# EAGLE design MAX1551_LiPo_Charger_Circuit_Ver01 (EAGLE 5.11)
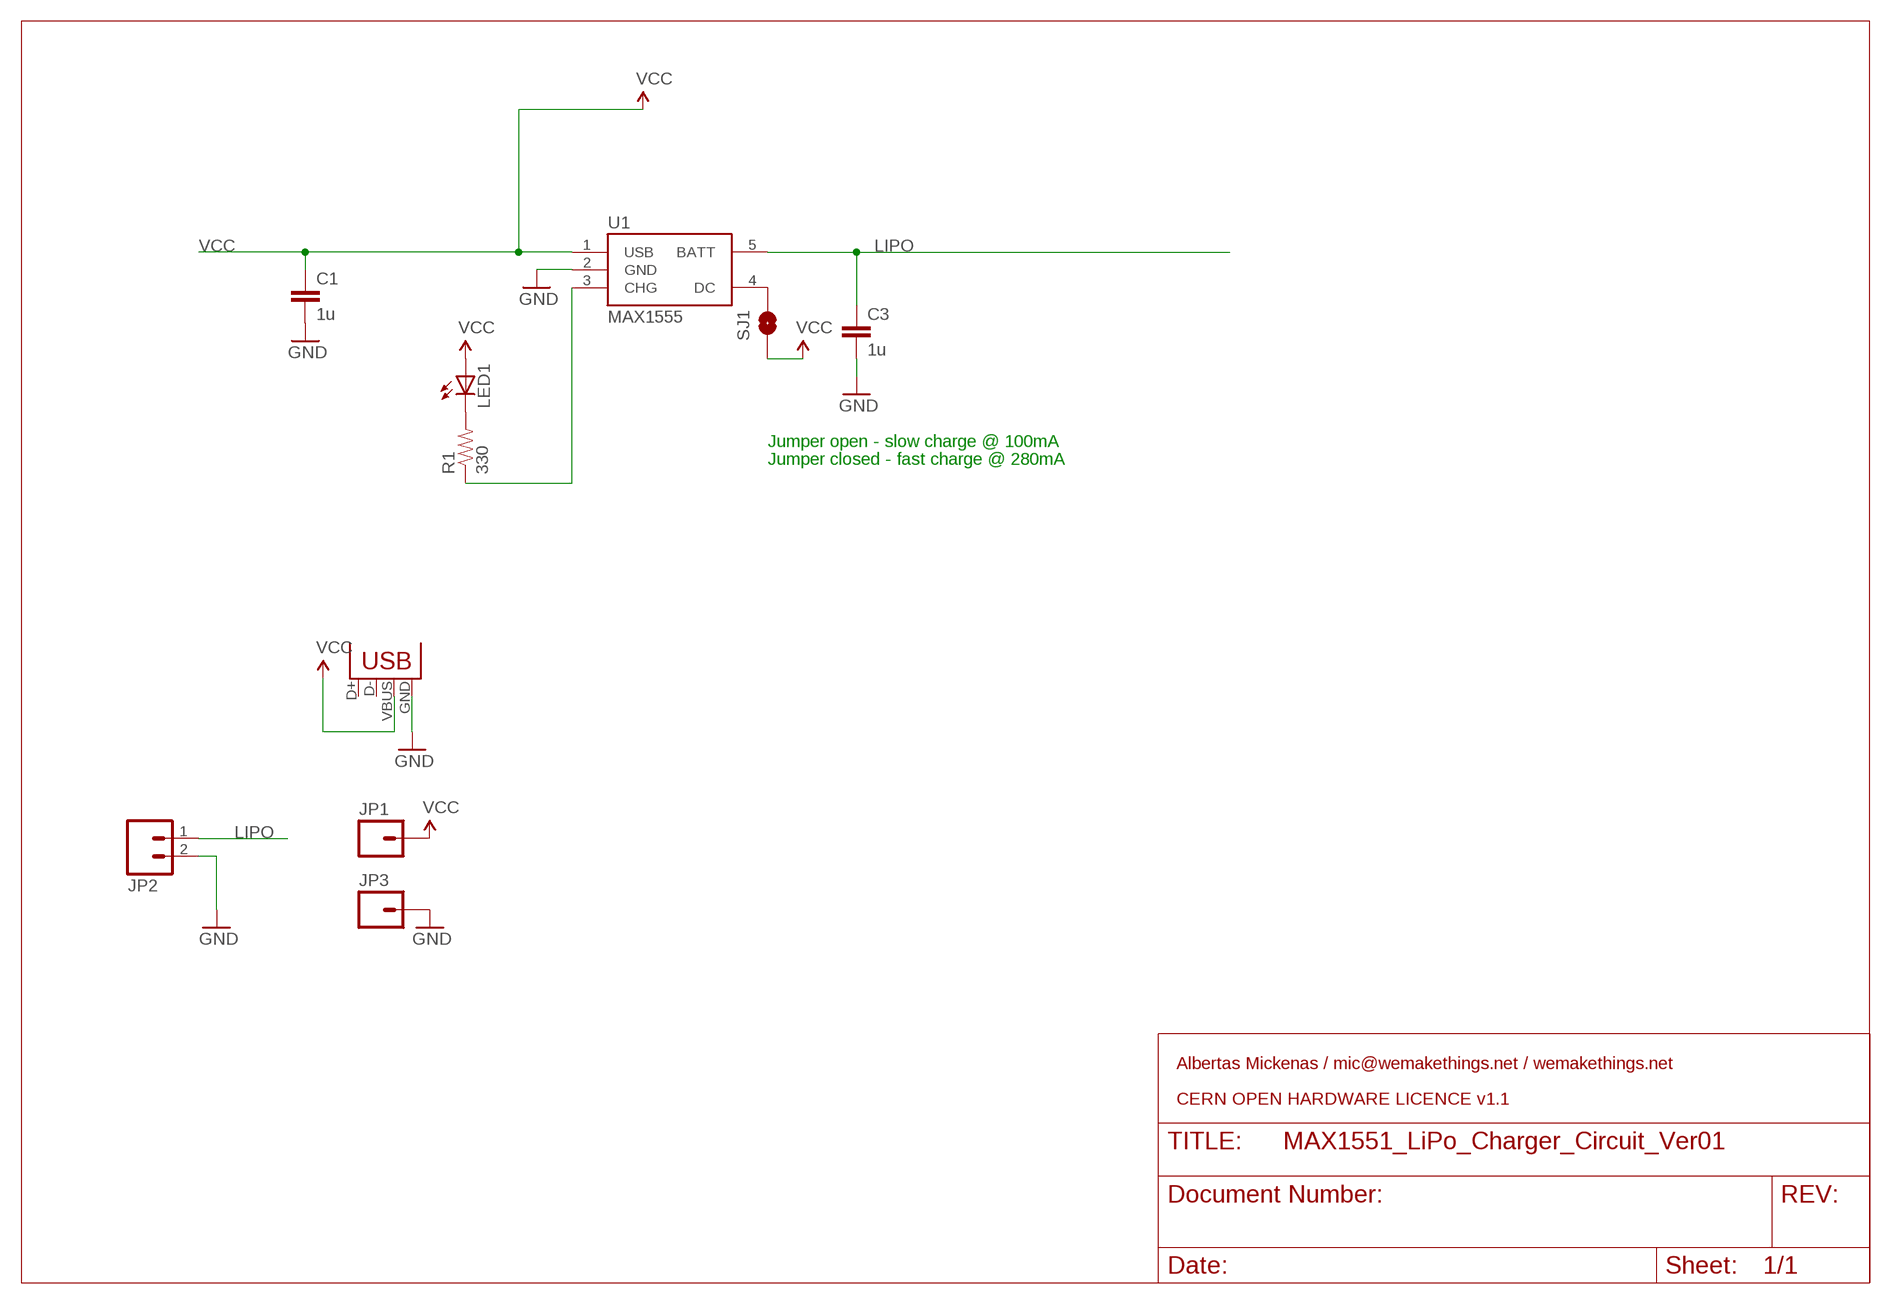
[diagram p0: schematic, sheet 1]

## Parts
C1  1u  CAP0805  [0805]
C3  1u  CAP0805  [0805]
JP1  M01PTH_LONGPAD  [1X01_LONGPAD]
JP2  M02PTH3  [1X02_LONGPADS]
JP3  M01PTH_LONGPAD  [1X01_LONGPAD]
LED1  LEDCHIP-LED0805  [CHIP-LED0805]
R1  330  RESISTOR0603-RES  [0603-RES]
SJ1  SOLDERJUMPERNC2  [SJ_2S-NOTRACE]
U1  MAX1555  [SOT23-5]
X1  USBOLD  [USB-MINIB-OLD]

## Nets
GND: C1.2 C3.2 JP2.2 JP3.1 U1.2(GND) X1.GND
LIPO: C3.1 JP2.1 U1.5(BATT)
N$1: R1.1 U1.3(CHG)
N$3: LED1.C R1.2
N$6: SJ1.2 U1.4(DC)
VCC: C1.1 JP1.1 LED1.A SJ1.1 U1.1(USB) X1.VBUS
Unconnected: X1.D+ X1.D-

## Notes on the sheet
- Jumper open - slow charge @ 100mA
- Jumper closed - fast charge @ 280mA
- Albertas Mickenas / mic@wemakethings.net / wemakethings.net
- CERN OPEN HARDWARE LICENCE v1.1

## Library data of the parts
C1 C3 = SparkFun:CAP: Capacitor Standard 0603 ceramic capacitor, and 0.1" leaded capacitor.
JP1 JP3 = SparkFun:M01: Header 1 Standard 1-pin 0.1" header. Use with straight break away headers (SKU : PRT-00116), right angle break away headers (PRT-00553), swiss pins (PRT-00743), machine pins (PRT-00117), and female headers (PRT-00115).
JP2 = SparkFun:M02: Header 2 Standard 2-pin 0.1" header. Use with straight break away headers (SKU : PRT-00116), right angle break away headers (PRT-00553), swiss pins (PRT-00743), machine pins (PRT-00117), and female headers (PRT-00115). Molex polarized connector foot print use with SKU : PRT-08233 with associated crimp pins and housings.
LED1 = adafruit:LED: LED OSRAM: - CHIPLED LG R971, LG N971, LY N971, LG Q971, LY Q971, LO R971, LY R971 LH N974, LH R974 LS Q976, LO Q976, LY Q976 LO Q996 - Hyper CHIPLED LW Q18S LB Q993, LB Q99A, LB R99A - SideLED LS A670, LO A670, LY A670, LG A670, LP A670 LB A673, LV A673, LT A673, LW A673 LH A674 LY A675 LS A676, LA A676, LO A676, LY A676, LW A676 LS A679, LY A679, LG A679 - Hyper Micro SIDELED® LS Y876, LA Y876, LO Y876, LY Y876 LT Y87S - SmartLED LW L88C, LW L88S LB L89C, LB L89S, LG L890 LS L89K, LO L89K, LY L89K LS L896, LA L896, LO L896, LY L896 - TOPLED LS T670, LO T670, LY T670, LG T670, LP T670 LSG T670, LSP T670, LSY T670, LOP T670, LYG T670 LG T671, LOG T671, LSG T671 LB T673, LV T673, LT T673, LW T673 LH T674 LS T676, LA T676, LO T676, LY T676, LB T676, LH T676, LSB T676, LW T676 LB T67C, LV T67C, LT T67C, LS T67K, LO T67K, LY T67K, LW E67C LS E67B, LA E67B, LO E67B, LY E67B, LB E67C, LV E67C, LT E67C LW T67C LS T679, LY T679, LG T679 LS T770, LO T770, LY T770, LG T770, LP T770 LB T773, LV T773, LT T773, LW T773 LH T774 LS E675, LA E675, LY E675, LS T675 LS T776, LA T776, LO T776, LY T776, LB T776 LHGB T686 LT T68C, LB T68C - Hyper Mini TOPLED® LB M676 - Mini TOPLED Santana® LG M470 LS M47K, LO M47K, LY M47K Source: http://www.osram.convergy.de/
R1 = SparkFun:RESISTOR: Resistor Basic schematic elements and footprints for 0603, 1206, and PTH resistors.
SJ1 = SparkFun:SOLDERJUMPER: Solder Jumper Standard SMD solder jumper. Used to automate production. Two varients : Normally Open and Normally Closed are the same, but have different paste layers. NC will have a large amount of paste and should jumper during reflow.
U1 = SparkFun:MAX1555: MAX1555 Lithium Charger IC SOT-23 Lithium Polymer charging IC. Schematic element and footprint proven. Spark Fun Electronics SKU : COM-00674
X1 = SparkFun:USB: USB Connectors USB-B-PTH is fully proven SKU : PRT-00139 USB-miniB is fully proven SKU : PRT-00587 USB-A-PCB is untested. USB-A-H is throughly reviewed, but untested. Spark Fun Electronics SKU : PRT-00437 USB-B-SMT is throughly reviewed, but untested. Needs silkscreen touching up. USB-A-S has not been used/tested USB-MB-H has not been used/tested

## Board
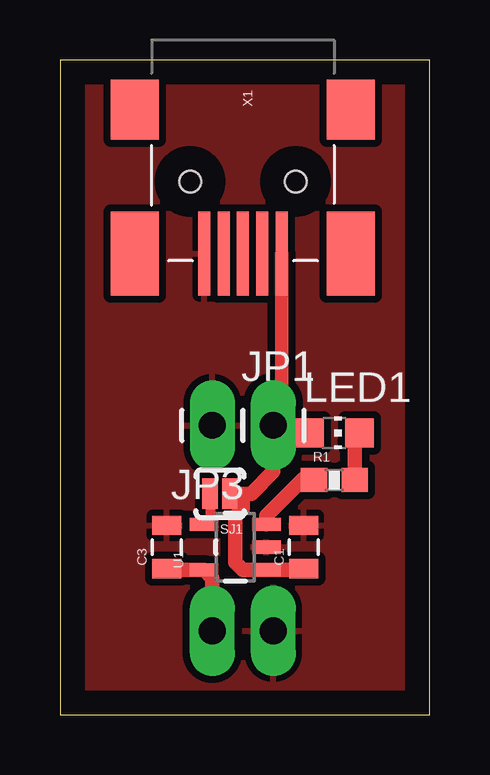
[diagram p1: board, top side]

Size 15.41 x 27.3 mm. Coordinates in mm from the lower left corner, seen from the top.
Outline: 0,0 15.41,0 15.41,27.3 0,27.3 0,0
Copper layers (1*16): Top 0.035mm / dielectric 1.5mm / Bottom 0.035mm
Design rules "default": minimum track width 10mil, minimum drill 24mil, track to track 8mil, track to pad 8mil, pad to pad 8mil, via to via 8mil, smd to smd 8mil, copper to edge 40mil, drill to drill 8mil, minimum pad ring 10mil, minimum via ring 8mil, stop-mask expansion 4mil, vias tented up to drill 0mil, thermal gap 10mil

### Footprints (pad centres in the part's own frame; a part is rotated, then mirrored left to right if it is on the bottom)
0805 = smd 0.8 x 1.2: 1 -0.9,0; 2 0.9,0
1X01_LONGPAD = drill 1.118 pad 1.88 long: 1 0,0
1X02_LONGPADS = drill 1.118 pad 1.88 long: 1 0,0; 2 2.54,0
CHIP-LED0805 = smd 1.2 x 1.2: A 0,-1.05; C 0,1.05
0603-RES = smd 1.1 x 1: 1 -0.85,0; 2 0.85,0
SJ_2S-NOTRACE = smd 0.635 x 1.27: 1 -0.401,0; 2 0.413,0
SOT23-5 = smd 0.55 x 1.2: 1 -0.95,-1.3; 2 0,-1.3; 3 0.95,-1.3; 4 0.95,1.3; 5 -0.95,1.3
USB-MINIB-OLD = smd 2.5 x 2: 1 -3,-4.5; 2 -3,4.5 | smd 3.5 x 2: 3 3,-4.5; 4 3,4.5 | smd 3.5 x 0.5: D+ 3,0; D- 3,0.8; GND 3,-1.6; ID 3,-0.8; VBUS 3.01,1.61 | hole 0.9: 0,2.2; 0,-2.2

### Placement (x,y rotation side)
C1  10.16,6.99 90 top
C3  4.45,6.99 90 top
JP1  8.89,12.06 0 top
JP2  6.35,3.49 0 top
JP3  6.35,12.06 180 top
LED1  11.43,11.75 270 top
R1  11.43,9.78 0 top
SJ1  6.67,9.21 180 top
U1  7.3,6.99 90 top
X1  7.62,22.23 270 top

### Tracks (layer width: path | path; a pad name or v marks a point on that pad's centre or on a via)
GND
  pour Top (isolate 0.305): 0,27.94 15.24,27.94 15.24,0 0,0
LIPO
  Top 0.61: C3.1 4.5,6.04 U1.5 6.35,5.69 JP2.1
N$1
  Top 0.61: U1.3 8.6,8.29 10.16,9.84 10.52,9.84 R1.1
N$3
  Top 0.508: LED1.C 12.13,11.4
  Top 0.61: R1.2 12.28,11.55 LED1.C
N$6
  Top 0.406: 6.03,7.93 U1.4 6.25,8.19 SJ1.2
VCC
  Top 0.406: SJ1.1 7.07,8.81
  Top 0.559: 8.89,11.43 8.91,11.45 | X1.VBUS 9.23,12.4 JP1.1
  Top 0.61: 7.62,9.21 SJ1.1 | 7.62,9.21 7.96,9.21 8.89,10.14 8.89,11.43 | 7.62,9.21 7.62,8.57 7.3,8.26 7.3,6.35 7.62,6.04 U1.1 10.11,6.04 C1.1 | 8.89,11.43 JP1.1 | LED1.A 9.21,11.75 8.89,11.43